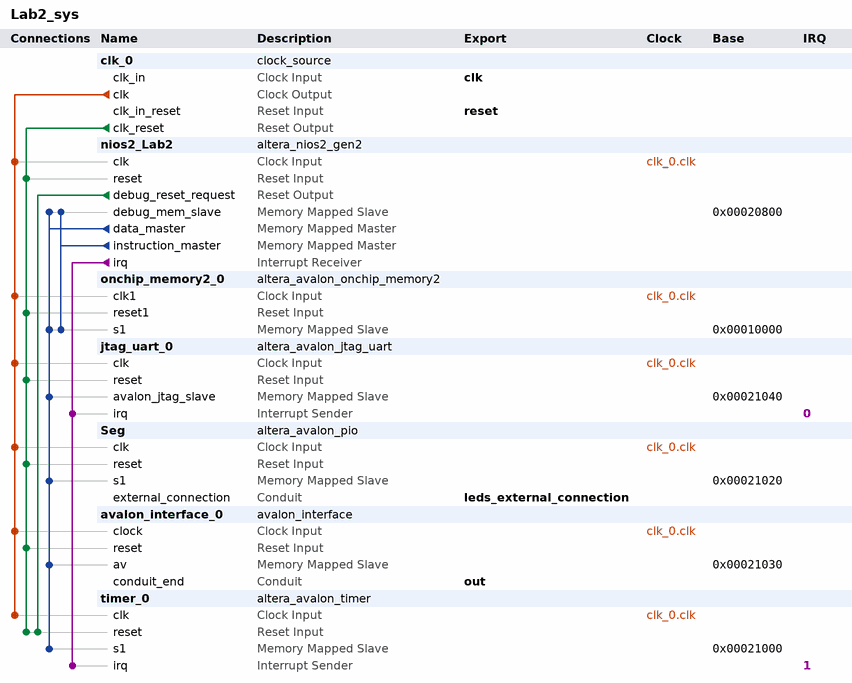
[diagram p0: system contents]
# Platform Designer (Qsys) system Lab2_sys, MAX 10 10M50DAF484C7G
# Parameters at their usual value, and those the tool derives, are not listed.
package require -exact qsys 18.1
create_system Lab2_sys
set_project_property DEVICE_FAMILY {MAX 10}
set_project_property DEVICE 10M50DAF484C7G

add_instance clk_0 clock_source 18.1
set_instance_parameter_value clk_0 clockFrequency 50000000

add_instance nios2_Lab2 altera_nios2_gen2 18.1
set_instance_parameter_value nios2_Lab2 dcache_size 2048
set_instance_parameter_value nios2_Lab2 exceptionSlave onchip_memory2_0.s1
set_instance_parameter_value nios2_Lab2 icache_size 4096
set_instance_parameter_value nios2_Lab2 impl Tiny
set_instance_parameter_value nios2_Lab2 resetSlave onchip_memory2_0.s1

add_instance onchip_memory2_0 altera_avalon_onchip_memory2 18.1
set_instance_parameter_value onchip_memory2_0 dataWidth 32
set_instance_parameter_value onchip_memory2_0 dualPort false
set_instance_parameter_value onchip_memory2_0 initMemContent true
set_instance_parameter_value onchip_memory2_0 initializationFileName C:/Users/Ahmed/Documents/GitHub/EL-Wasmi_Lab2/software/Lab2/mem_init/Lab2_sys_onchip_memory2_0.hex
set_instance_parameter_value onchip_memory2_0 memorySize 40960
set_instance_parameter_value onchip_memory2_0 useNonDefaultInitFile true

add_instance jtag_uart_0 altera_avalon_jtag_uart 18.1
set_instance_parameter_value jtag_uart_0 simInteractiveOptions NO_INTERACTIVE_WINDOWS

add_instance Seg altera_avalon_pio 18.1
set_instance_parameter_value Seg direction Output
set_instance_parameter_value Seg width 8

add_instance avalon_interface_0 avalon_interface 1.0

add_instance timer_0 altera_avalon_timer 18.1
set_instance_parameter_value timer_0 period 1
set_instance_parameter_value timer_0 periodUnits SEC

# connections
add_connection clk_0.clk avalon_interface_0.clock clock
add_connection clk_0.clk jtag_uart_0.clk clock
add_connection clk_0.clk nios2_Lab2.clk clock
add_connection clk_0.clk onchip_memory2_0.clk1 clock
add_connection clk_0.clk Seg.clk clock
add_connection clk_0.clk timer_0.clk clock
add_connection clk_0.clk_reset avalon_interface_0.reset reset
add_connection clk_0.clk_reset jtag_uart_0.reset reset
add_connection clk_0.clk_reset nios2_Lab2.reset reset
add_connection clk_0.clk_reset onchip_memory2_0.reset1 reset
add_connection clk_0.clk_reset Seg.reset reset
add_connection clk_0.clk_reset timer_0.reset reset
add_connection nios2_Lab2.debug_reset_request timer_0.reset reset
add_connection nios2_Lab2.data_master avalon_interface_0.av avalon
set_connection_parameter_value nios2_Lab2.data_master/avalon_interface_0.av baseAddress 0x00021030
add_connection nios2_Lab2.data_master jtag_uart_0.avalon_jtag_slave avalon
set_connection_parameter_value nios2_Lab2.data_master/jtag_uart_0.avalon_jtag_slave baseAddress 0x00021040
add_connection nios2_Lab2.data_master nios2_Lab2.debug_mem_slave avalon
set_connection_parameter_value nios2_Lab2.data_master/nios2_Lab2.debug_mem_slave baseAddress 0x00020800
add_connection nios2_Lab2.data_master onchip_memory2_0.s1 avalon
set_connection_parameter_value nios2_Lab2.data_master/onchip_memory2_0.s1 baseAddress 0x00010000
add_connection nios2_Lab2.data_master Seg.s1 avalon
set_connection_parameter_value nios2_Lab2.data_master/Seg.s1 baseAddress 0x00021020
add_connection nios2_Lab2.data_master timer_0.s1 avalon
set_connection_parameter_value nios2_Lab2.data_master/timer_0.s1 baseAddress 0x00021000
add_connection nios2_Lab2.instruction_master nios2_Lab2.debug_mem_slave avalon
set_connection_parameter_value nios2_Lab2.instruction_master/nios2_Lab2.debug_mem_slave baseAddress 0x00020800
add_connection nios2_Lab2.instruction_master onchip_memory2_0.s1 avalon
set_connection_parameter_value nios2_Lab2.instruction_master/onchip_memory2_0.s1 baseAddress 0x00010000
add_connection nios2_Lab2.irq jtag_uart_0.irq interrupt
set_connection_parameter_value nios2_Lab2.irq/jtag_uart_0.irq irqNumber 0
add_connection nios2_Lab2.irq timer_0.irq interrupt
set_connection_parameter_value nios2_Lab2.irq/timer_0.irq irqNumber 1

# exported interfaces
add_interface clk clock sink
set_interface_property clk EXPORT_OF clk_0.clk_in
add_interface leds_external_connection conduit end
set_interface_property leds_external_connection EXPORT_OF Seg.external_connection
add_interface out conduit end
set_interface_property out EXPORT_OF avalon_interface_0.conduit_end
add_interface reset reset sink
set_interface_property reset EXPORT_OF clk_0.clk_in_reset

set_interconnect_requirement {$system} qsys_mm.clockCrossingAdapter HANDSHAKE
set_interconnect_requirement {$system} qsys_mm.enableEccProtection FALSE
set_interconnect_requirement {$system} qsys_mm.insertDefaultSlave FALSE
set_interconnect_requirement {$system} qsys_mm.maxAdditionalLatency 1

save_system Lab2_sys.qsys
